# Altium schematic sheet Top.SchDoc: Projekt DAC AUPSC 2019
size A4; Date: 4.10.2019; Author: Michal Grzegorzek; SheetNumber: 1; SheetTotal: 4; Model: EM1; PageSetup: Record=PageOptions|CenterHorizontal=True|CenterVertical=True|PrintScale=0.52|XCorrection=1.00|YCorrection=1.00|PrintKind=1|BorderSize=5000000|LeftOffset=0|BottomOffset=0|Orientation=2|PaperLength=4200|PaperWidth=2970|Scale=100|PaperSource=7|PrintQuality=600|MediaType=1|DitherType=10|PaperKind=A3|PrintScaleMode=1
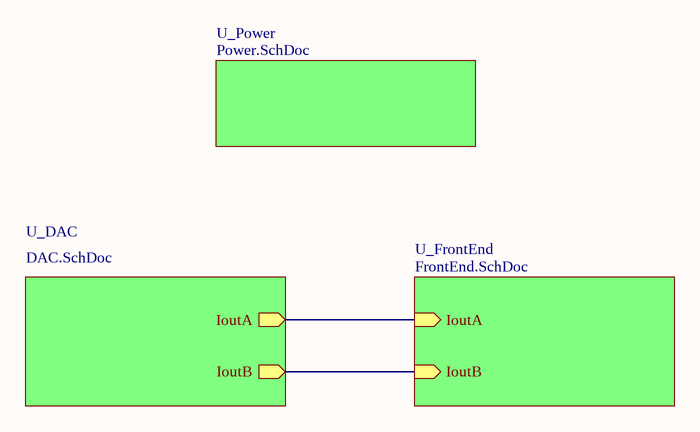
[diagram p0: Top.SchDoc]

## Sub-sheets
U_DAC = DAC.SchDoc: IoutA (out), IoutB (out)
U_FrontEnd = FrontEnd.SchDoc: IoutA (in), IoutB (in)
U_Power = Power.SchDoc: no entries

## Nets
(unnamed): sheet U_DAC/IoutA, sheet U_FrontEnd/IoutA
(unnamed): sheet U_DAC/IoutB, sheet U_FrontEnd/IoutB

## Notes on the sheet
- Title:
- Sheet:
- of
- Author:
- Model:
- Document Number:
- Checked by:
- Iss-Rev:
- Approved by:
- Date:
- File name: